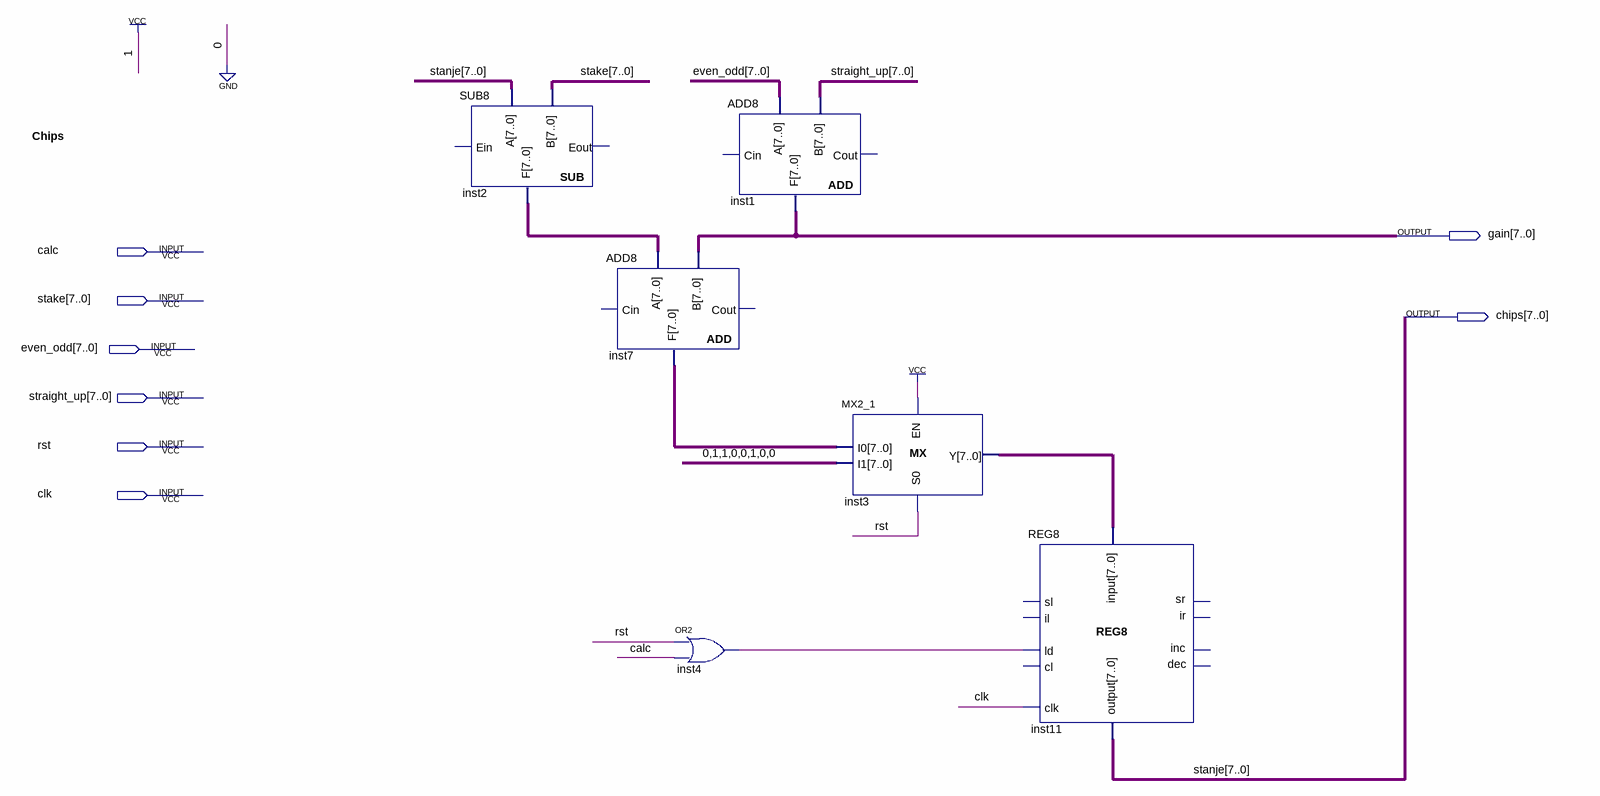
[diagram p0: schematic sheet]
// Quartus schematic Chips.bdf as structural Verilog: 6 symbols, 8 pins
module Chips (
  input  calc,
  input  [7:0] stake,
  input  [7:0] even_odd,
  input  [7:0] straight_up,
  input  rst,
  input  clk,
  output [7:0] gain,
  output [7:0] chips
);

  wire inst4_out;
  wire [7:0] inst2_f, inst3_y, inst7_f;

  SUB8 inst2 (.A(chips), .B(stake), .F(inst2_f));  // open: Ein, Eout
  ADD8 inst7 (.A(inst2_f), .B(gain), .F(inst7_f));  // open: Cin, Cout
  ADD8 inst1 (.A(even_odd), .B(straight_up), .F(gain));  // open: Cin, Cout
  or inst4 (inst4_out, rst, calc);
  MX2_1 inst3 (.I1(8'b01100100), .I0(inst7_f), .S0(rst), .EN(1'b1), .Y(inst3_y));
  REG8 inst11 (.clk(clk), .ld(inst4_out), .\input (inst3_y), .\output (chips));  // open: sr, ir, sl, il, inc, dec, cl

  // Other names for the same wires on the sheet: stanje[7:0] = chips

  // Notes on the sheet:
  //   Chips
endmodule
